# EAGLE design Net4CPC (EAGLE 9.6.2)
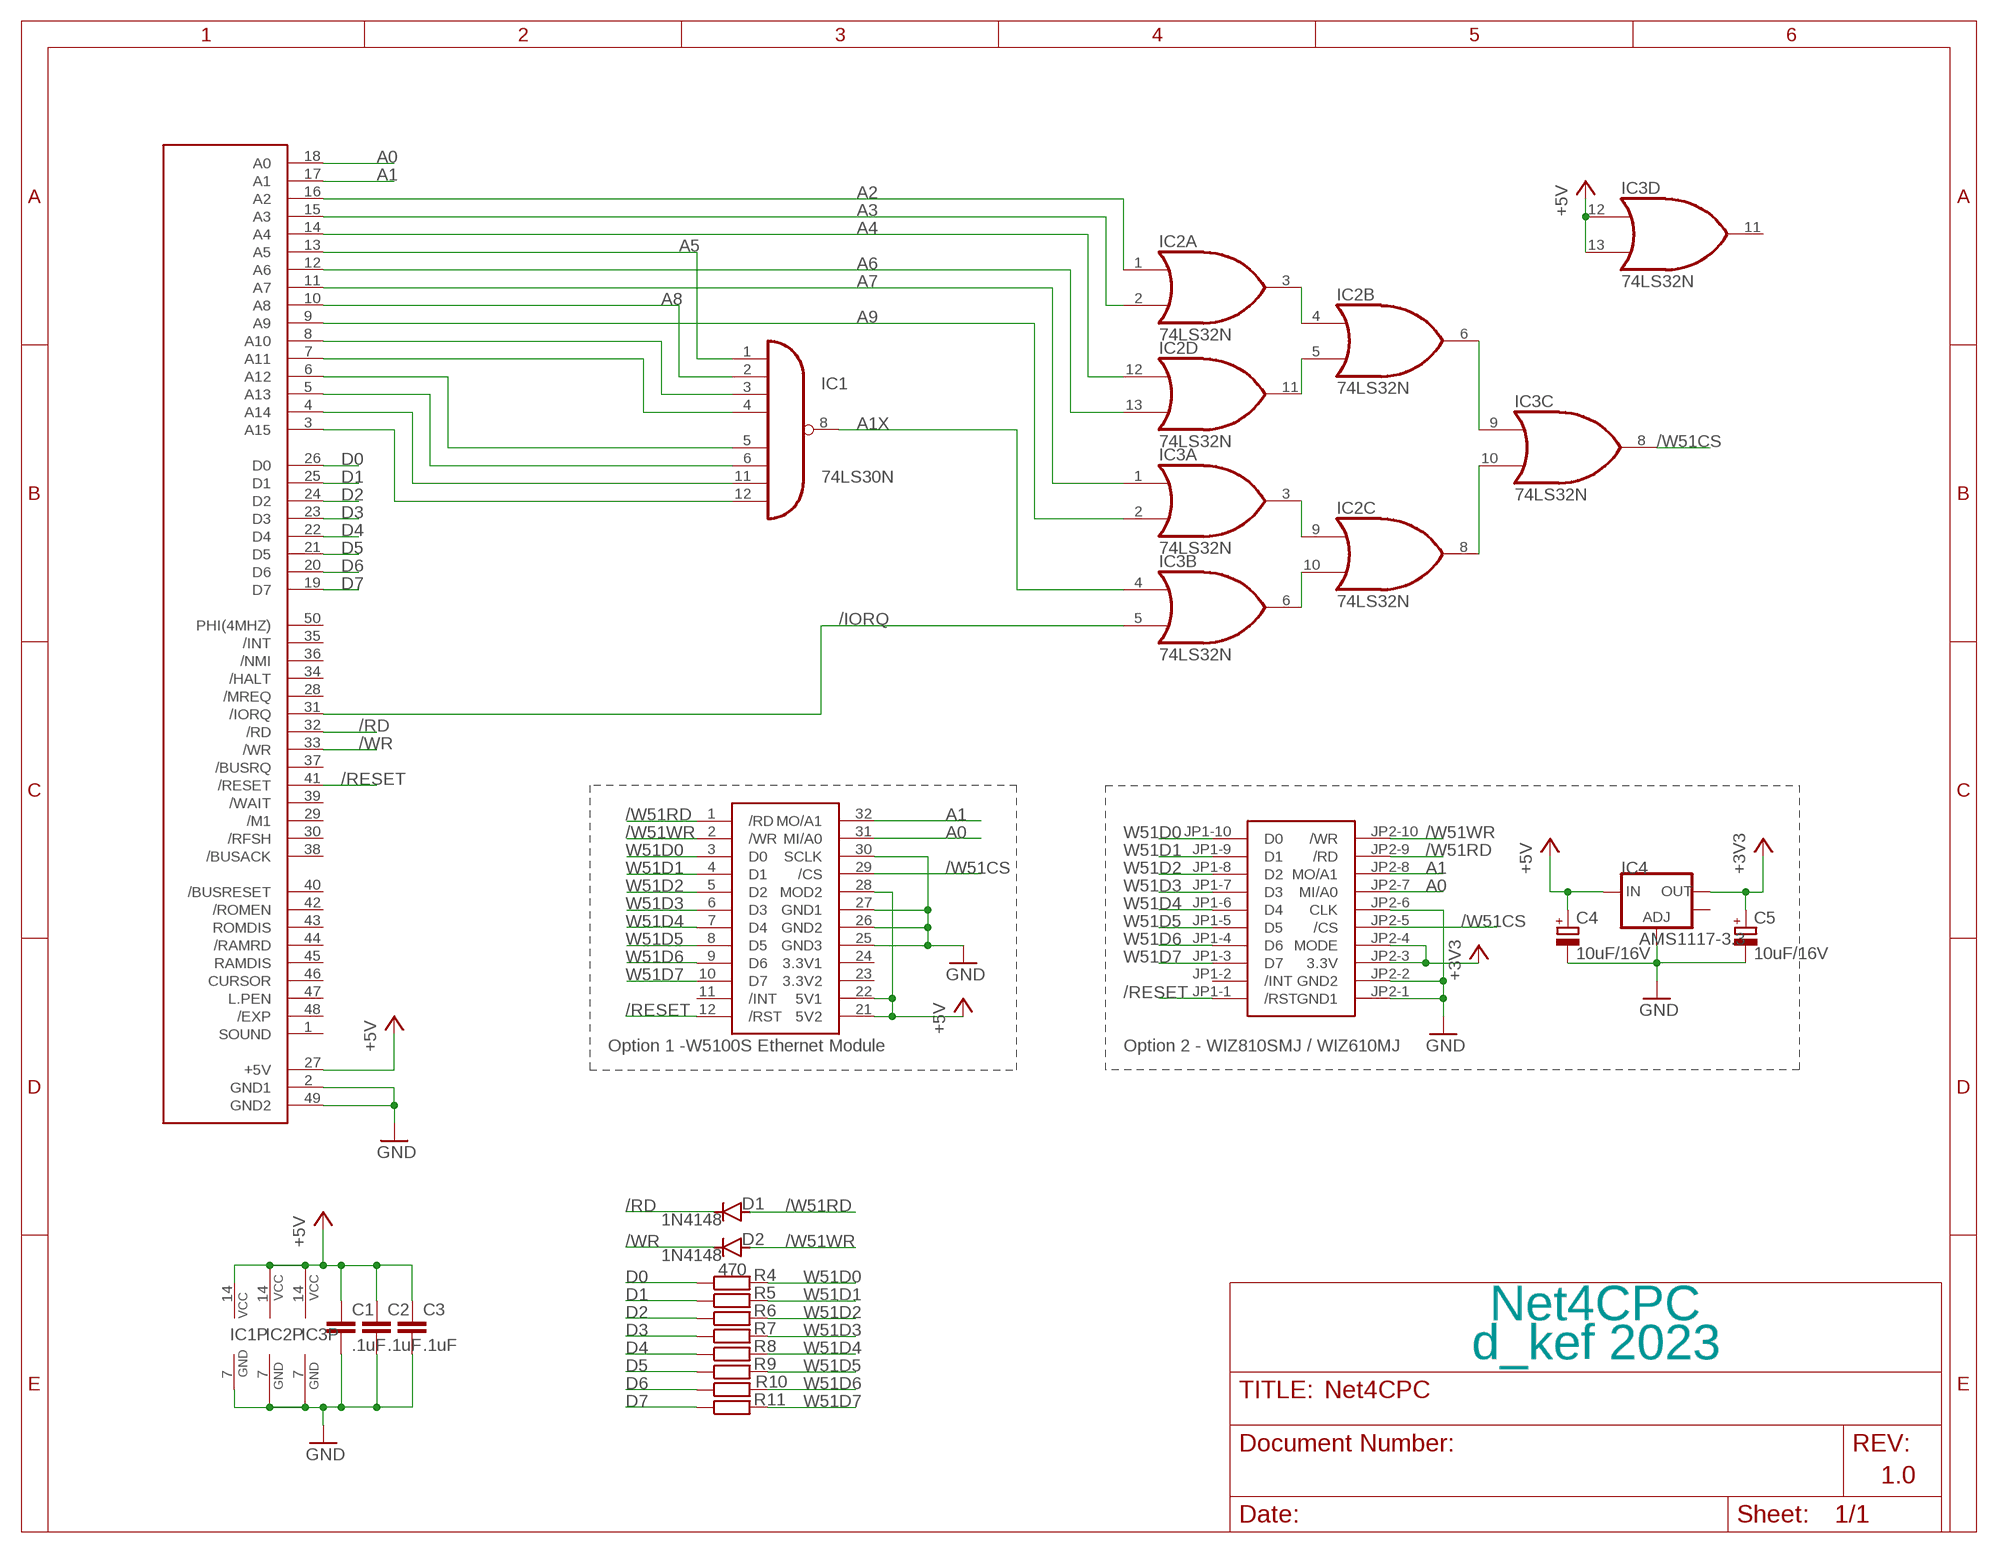
[diagram p0: schematic, sheet 1]
FRAME1 (FRAME_A_L): BANNER1: Net4CPC; BANNER2: d_kef 2023; REVISION: 1.0; TITLE: Net4CPC

## Parts
C1  .1uF  C-EU025-025X050  [C025-025X050]
C2  .1uF  C-EU025-025X050  [C025-025X050]
C3  .1uF  C-EU025-025X050  [C025-025X050]
C4  10uF/16V  CPOL-EUE5-6  [E5-6]
C5  10uF/16V  CPOL-EUE5-6  [E5-6]
CON1  CPCBUS  AMSTRAD_CPC_BUSP  [2X25]
D1  1N4148  1N4148DO35-7  [DO35-7]
D2  1N4148  1N4148DO35-7  [DO35-7]
IC1  74LS30N  74HCT30N  [DIL14]
IC2  74LS32N  [DIL14]
IC3  74LS32N  [DIL14]
IC4  AMS1117-3.3  V_REG_LM1117SOT223  [SOT223]
R4  470  R-EU_0204/7  [0204/7]
R5  470  R-EU_0204/7  [0204/7]
R6  470  R-EU_0204/7  [0204/7]
R7  470  R-EU_0204/7  [0204/7]
R8  470  R-EU_0204/7  [0204/7]
R9  470  R-EU_0204/7  [0204/7]
R10  470  R-EU_0204/7  [0204/7]
R11  470  R-EU_0204/7  [0204/7]
W5100S-MODULE  W5100S-NETWORK-MODULENO-NAMES  [W5100S-NETWORK-MODULE-NO-NAMES]
WIZ810SMJ  WIZ810SMJ-NETWORK-MODULENO-NAMES  [WIZ810SMJ-NETWORK-MODULE-NO-NAMES]

## Nets
+3V3 [power]: C5.+ IC4.2(OUT) WIZ810SMJ.JP2-3(3.3V) WIZ810SMJ.JP2-4(MODE)
+5V [power]: C1.1 C2.1 C3.1 C4.+ CON1.27(+5V) IC1.14(VCC) IC2.14(P:VCC) IC3.12(D:I0) IC3.13(D:I1) IC3.14(P:VCC) IC4.3(IN) W5100S-MODULE.21(5V2) W5100S-MODULE.22(5V1) W5100S-MODULE.28(MOD2)
/IORQ: CON1.31(/IORQ) IC3.5(B:I1)
/RD: CON1.32(/RD) D1.C
/RESET: CON1.41(/RESET) W5100S-MODULE.12(/RST) WIZ810SMJ.JP1-1(/RST)
/W51CS: IC3.8(C:O) W5100S-MODULE.29(/CS) WIZ810SMJ.JP2-5(/CS)
/W51RD: D1.A W5100S-MODULE.1(/RD) WIZ810SMJ.JP2-9(/RD)
/W51WR: D2.A W5100S-MODULE.2(/WR) WIZ810SMJ.JP2-10(/WR)
/WR: CON1.33(/WR) D2.C
A0: CON1.18(A0) W5100S-MODULE.31(MI/A0) WIZ810SMJ.JP2-7(MI/A0)
A1: CON1.17(A1) W5100S-MODULE.32(MO/A1) WIZ810SMJ.JP2-8(MO/A1)
A1X: IC1.8(O) IC3.4(B:I0)
A2: CON1.16(A2) IC2.1(A:I0)
A3: CON1.15(A3) IC2.2(A:I1)
A4: CON1.14(A4) IC2.12(D:I0)
A5: CON1.13(A5) IC1.1(I0)
A6: CON1.12(A6) IC2.13(D:I1)
A7: CON1.11(A7) IC3.1(A:I0)
A8: CON1.10(A8) IC1.2(I1)
A9: CON1.9(A9) IC3.2(A:I1)
A10: CON1.8(A10) IC1.3(I2)
A11: CON1.7(A11) IC1.4(I3)
A12: CON1.6(A12) IC1.5(I4)
A13: CON1.5(A13) IC1.6(I5)
D0: CON1.26(D0) R4.1
D1: CON1.25(D1) R5.1
D2: CON1.24(D2) R6.1
D3: CON1.23(D3) R7.1
D4: CON1.22(D4) R8.1
D5: CON1.21(D5) R9.1
D6: CON1.20(D6) R10.1
D7: CON1.19(D7) R11.1
GND [power]: C1.2 C2.2 C3.2 C4.- C5.- CON1.2(GND1) CON1.49(GND2) IC1.7(GND) IC2.7(P:GND) IC3.7(P:GND) IC4.1(ADJ) W5100S-MODULE.25(GND3) W5100S-MODULE.26(GND2) W5100S-MODULE.27(GND1) W5100S-MODULE.30(SCLK) WIZ810SMJ.JP2-1(GND1) WIZ810SMJ.JP2-2(GND2) WIZ810SMJ.JP2-6(CLK)
N$1: CON1.3(A15) IC1.12(I7)
N$2: CON1.4(A14) IC1.11(I6)
N$3: IC2.3(A:O) IC2.4(B:I0)
N$4: IC2.5(B:I1) IC2.11(D:O)
N$5: IC2.9(C:I0) IC3.3(A:O)
N$6: IC2.10(C:I1) IC3.6(B:O)
N$7: IC2.6(B:O) IC3.9(C:I0)
N$8: IC2.8(C:O) IC3.10(C:I1)
W51D0: R4.2 W5100S-MODULE.3(D0) WIZ810SMJ.JP1-10(D0)
W51D1: R5.2 W5100S-MODULE.4(D1) WIZ810SMJ.JP1-9(D1)
W51D2: R6.2 W5100S-MODULE.5(D2) WIZ810SMJ.JP1-8(D2)
W51D3: R7.2 W5100S-MODULE.6(D3) WIZ810SMJ.JP1-7(D3)
W51D4: R8.2 W5100S-MODULE.7(D4) WIZ810SMJ.JP1-6(D4)
W51D5: R9.2 W5100S-MODULE.8(D5) WIZ810SMJ.JP1-5(D5)
W51D6: R10.2 W5100S-MODULE.9(D6) WIZ810SMJ.JP1-4(D6)
W51D7: R11.2 W5100S-MODULE.10(D7) WIZ810SMJ.JP1-3(D7)
Unconnected: CON1.1(SOUND) CON1.28(/MREQ) CON1.29(/M1) CON1.30(/RFSH) CON1.34(/HALT) CON1.35(/INT) CON1.36(/NMI) CON1.37(/BUSRQ) CON1.38(/BUSACK) CON1.39(/WAIT) CON1.40(/BUSRESET) CON1.42(/ROMEN) CON1.43(ROMDIS) CON1.44(/RAMRD) CON1.45(RAMDIS) CON1.46(CURSOR) CON1.47(L.PEN) CON1.48(/EXP) CON1.50(PHI(4MHZ)) IC3.11(D:O) IC4.4(OUT) W5100S-MODULE.11(/INT) WIZ810SMJ.JP1-2(/INT)

## Notes on the sheet
- Option 1 -W5100S Ethernet Module | Option 2 - WIZ810SMJ / WIZ610MJ

## Power pins joined to a net without a drawn wire
3.3V1: W5100S-MODULE.24(3.3V1)
3.3V2: W5100S-MODULE.23(3.3V2)

## Library data of the parts
C1-C3 = rcl:C-EU: CAPACITOR, European symbol; SPICEPREFIX: C
C4 C5 = rcl:CPOL-EU: POLARIZED CAPACITOR, European symbol; SPICEPREFIX: C
CON1 = CPC:AMSTRAD_CPC_BUS: AMSTRAD CPC BUS CONNECTOR
D1 D2 = diode:1N4148: DIODE high speed (Philips)
IC1 = 74xx-eu:74*30: 8-input NAND gate
IC2 IC3 = 74xx-us:74*32: Quad 2-input OR gate
IC4 = SparkFun:V_REG_LM1117: Voltage Regulator LM1117 Standard adjustable voltage regulator but in SMD form. Spark Fun Electronics SKU : COM-00595
R4-R11 = rcl:R-EU_: RESISTOR, European symbol; SPICEPREFIX: R
W5100S-MODULE = W5100S Network Module:W5100S-NETWORK-MODULE: W5100S Module TCP/IP Ethernet Module SPI / Parallel Control Interface
WIZ810SMJ = WIZ810SMJ Network Module:WIZ810SMJ-NETWORK-MODULE: WIZ810SMJ is the network module that includes W5100S (TCP/IP hardwired chip, include PHY), MAG-JACK (RJ45 with X’FMR) with other glue logics. It can be used as a component and no effort is required to interface W5100S and Transformer.

## Net classes
0 default: width 0.203 mm, drill 0.102 mm, clearance 0.102 mm
1 power: width 0.61 mm, drill 0.102 mm, clearance 0.102 mm

## Board
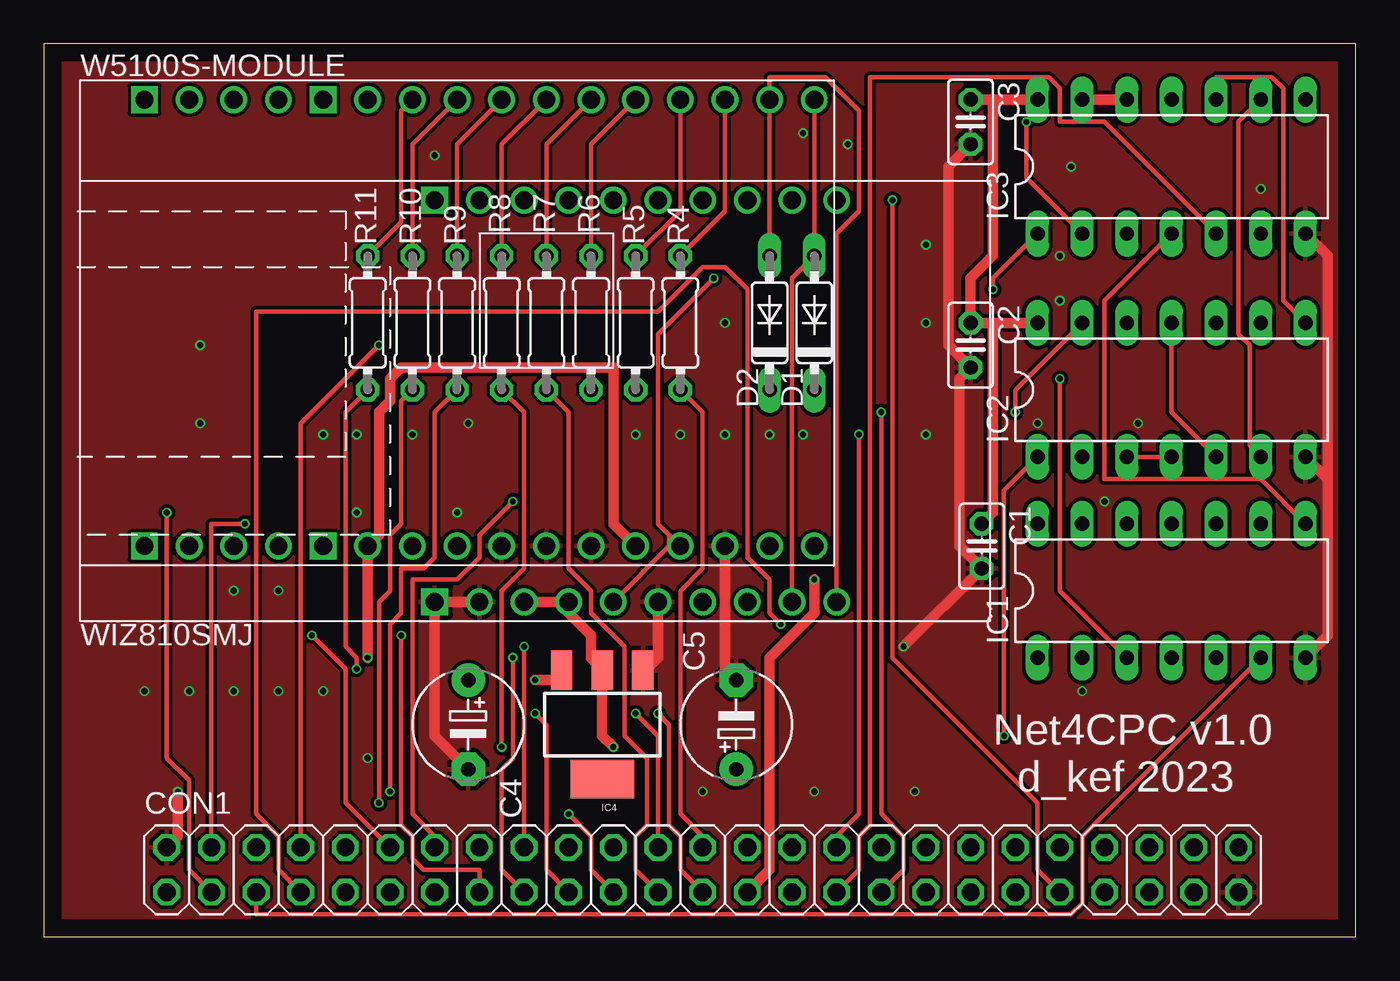
[diagram p1: board, top side]
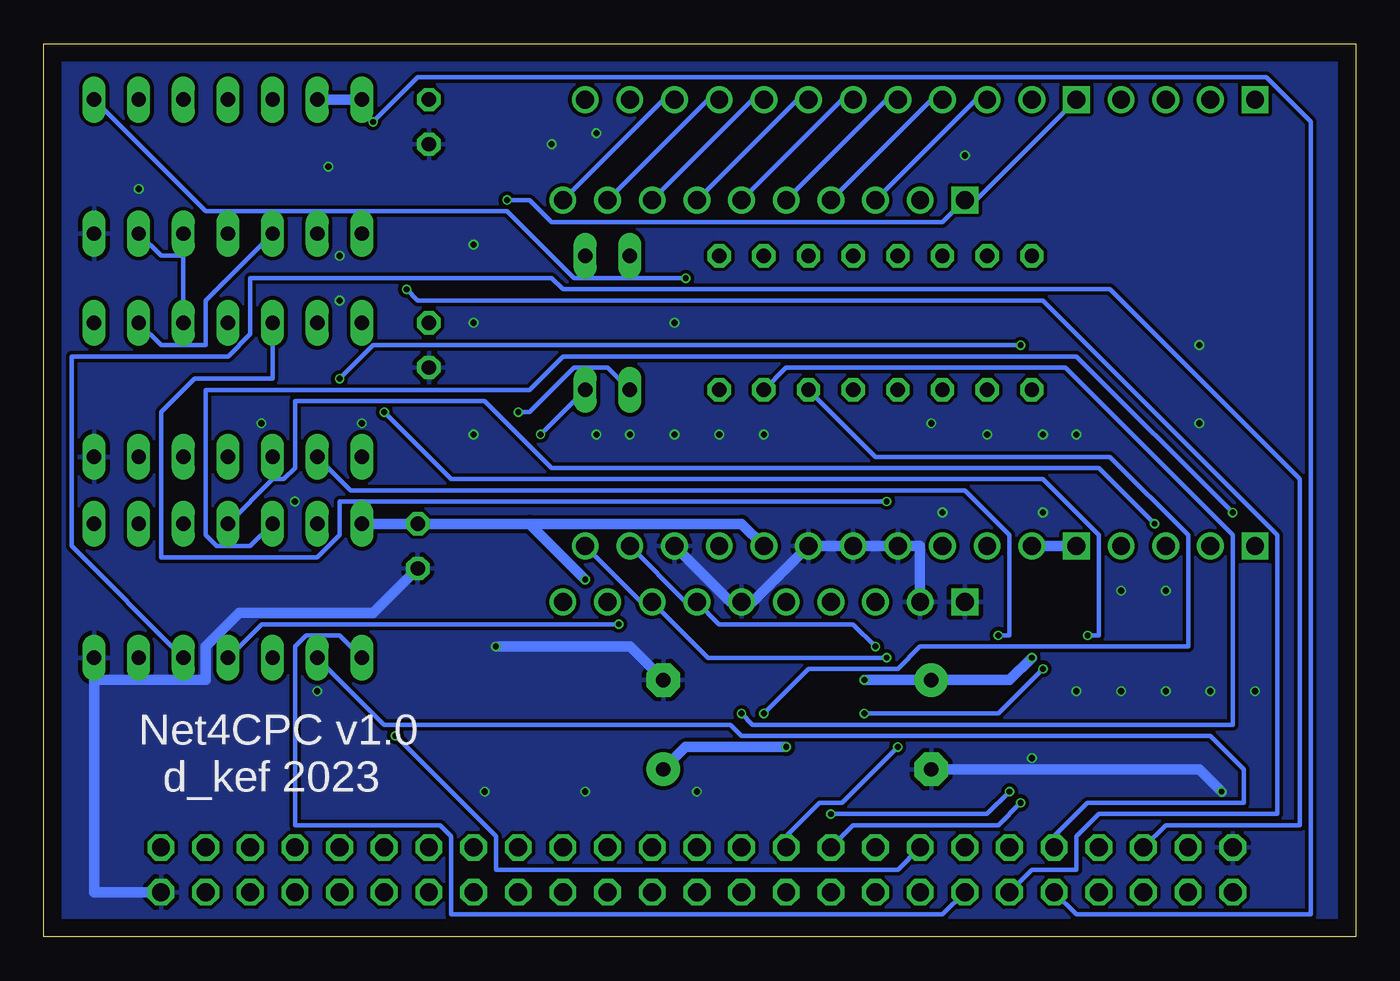
[diagram p2: board, bottom side, seen from below]

Size 74.6 x 50.79 mm. Coordinates in mm from the lower left corner, seen from the top.
Outline: 0,0 74.6,0 74.6,50.79 0,50.79 0,0
Copper layers (1*16): Top 0.035mm / dielectric 1.5mm / Bottom 0.035mm
Design rules "default *": minimum track width 10mil, minimum drill 13mil, track to track 8mil, track to pad 8mil, pad to pad 8mil, via to via 8mil, smd to smd 8mil, copper to edge 40mil, drill to drill 8mil, minimum pad ring 10mil, minimum via ring 4mil, stop-mask expansion 4mil, vias tented up to drill 25mil, thermal gap 10mil

### Footprints (pad centres in the part's own frame; a part is rotated, then mirrored left to right if it is on the bottom)
C025-025X050 = drill 0.813 octagon: 1 -1.27,0; 2 1.27,0
E5-6 = drill 0.813 pad 1.905: + -2.54,0 | drill 0.813 pad 1.905 octagon: - 2.54,0
2X25 = drill 1.016 octagon: 1 -30.48,-1.27; 2 -30.48,1.27; 3 -27.94,-1.27; 4 -27.94,1.27; 5 -25.4,-1.27; 6 -25.4,1.27; 7 -22.86,-1.27; 8 -22.86,1.27; 9 -20.32,-1.27; 10 -20.32,1.27; 11 -17.78,-1.27; 12 -17.78,1.27; 13 -15.24,-1.27; 14 -15.24,1.27; 15 -12.7,-1.27; 16 -12.7,1.27; 17 -10.16,-1.27; 18 -10.16,1.27; 19 -7.62,-1.27; 20 -7.62,1.27; 21 -5.08,-1.27; 22 -5.08,1.27; 23 -2.54,-1.27; 24 -2.54,1.27; 25 0,-1.27; 26 0,1.27; 27 2.54,-1.27; 28 2.54,1.27; 29 5.08,-1.27; 30 5.08,1.27; 31 7.62,-1.27; 32 7.62,1.27; 33 10.16,-1.27; 34 10.16,1.27; 35 12.7,-1.27; 36 12.7,1.27; 37 15.24,-1.27; 38 15.24,1.27; 39 17.78,-1.27; 40 17.78,1.27; 41 20.32,-1.27; 42 20.32,1.27; 43 22.86,-1.27; 44 22.86,1.27; 45 25.4,-1.27; 46 25.4,1.27; 47 27.94,-1.27; 48 27.94,1.27; 49 30.48,-1.27; 50 30.48,1.27
DO35-7 = drill 0.813 long: A 3.81,0; C -3.81,0
DIL14 = drill 0.813 long: 1 -7.62,-3.81; 2 -5.08,-3.81; 3 -2.54,-3.81; 4 0,-3.81; 5 2.54,-3.81; 6 5.08,-3.81; 7 7.62,-3.81; 8 7.62,3.81; 9 5.08,3.81; 10 2.54,3.81; 11 0,3.81; 12 -2.54,3.81; 13 -5.08,3.81; 14 -7.62,3.81
SOT223 = smd 1.219 x 2.235: 1 -2.311,-3.099; 2 0,-3.099; 3 2.311,-3.099 | smd 3.6 x 2.2: 4 0,3.099
0204/7 = drill 0.813 octagon: 1 -3.81,0; 2 3.81,0
W5100S-NETWORK-MODULE-NO-NAMES = drill 1.016: 1 -12.7,19.05; 2 -12.7,16.51; 3 -12.7,13.97; 4 -12.7,11.43; 5 -12.7,8.89; 6 -12.7,6.35; 7 -12.7,3.81; 8 -12.7,1.27; 9 -12.7,-1.27; 10 -12.7,-3.81; 11 -12.7,-6.35; 13 -12.7,-11.43; 14 -12.7,-13.97; 15 -12.7,-16.51; 18 12.7,-16.51; 19 12.7,-13.97; 20 12.7,-11.43; 22 12.7,-6.35; 23 12.7,-3.81; 24 12.7,-1.27; 25 12.7,1.27; 26 12.7,3.81; 27 12.7,6.35; 28 12.7,8.89; 29 12.7,11.43; 30 12.7,13.97; 31 12.7,16.51; 32 12.7,19.05 | drill 1.016 square: 12 -12.7,-8.89; 16 -12.7,-19.05; 17 12.7,-19.05; 21 12.7,-8.89
WIZ810SMJ-NETWORK-MODULE-NO-NAMES = drill 1.016 square: JP1-1 11.43,7.62; JP2-1 -11.43,7.62 | drill 1.016: JP1-2 11.43,5.08; JP1-3 11.43,2.54; JP1-4 11.43,0; JP1-5 11.43,-2.54; JP1-6 11.43,-5.08; JP1-7 11.43,-7.62; JP1-8 11.43,-10.16; JP1-9 11.43,-12.7; JP1-10 11.43,-15.24; JP2-2 -11.43,5.08; JP2-3 -11.43,2.54; JP2-4 -11.43,0; JP2-5 -11.43,-2.54; JP2-6 -11.43,-5.08; JP2-7 -11.43,-7.62; JP2-8 -11.43,-10.16; JP2-9 -11.43,-12.7; JP2-10 -11.43,-15.24

### Placement (x,y rotation side)
C1  53.34,22.23 270 top
C2  52.7,33.65 270 top
C3  52.7,46.35 270 top
C4  1uF/16V  [E5-6]  24.13,12.07 270 top
C5  1uF/16V  [E5-6]  39.37,12.07 90 top
CON1  37.47,3.81 0 top
D1  43.81,34.92 90 top
D2  41.28,34.92 90 top
IC1  64.13,19.68 0 top
IC2  64.13,31.11 0 top
IC3  64.13,43.81 0 top
IC4  31.75,12.07 180 top
R4  36.19,34.92 90 top
R5  33.66,34.92 90 top
R6  31.11,34.92 90 top
R7  28.57,34.92 90 top
R8  26.04,34.92 90 top
R9  23.5,34.92 90 top
R10  20.96,34.92 90 top
R11  18.42,34.92 90 top
W5100S-MODULE  24.76,34.92 270 top
WIZ810SMJ  29.85,30.48 90 top

### Tracks (layer width: path | path; a pad name or v marks a point on that pad's centre or on a via)
+3V3  (via drill 0.33)
  Top 0.61: WIZ810SMJ.JP2-3 WIZ810SMJ.JP2-4 29.85,18.41 31.11,17.14 31.11,15.88 31.75,15.24 IC4.2 31.75,11.43 v32.39,10.79
  Bottom 0.61: C5.+ 38.1,10.79 v32.39,10.79
+5V  (via drill 0.33)
  Top 0.61: v27.94,14.61 29.21,14.61 IC4.3 | v18.42,15.88 W5100S-MODULE.22 19.05,22.86 19.05,29.84 19.68,30.48 19.68,31.75 20.32,32.38 32.39,32.38 32.39,23.5 W5100S-MODULE.28 | IC3.12 IC3.13 | IC3.14 53.97,47.62 | 53.97,47.62 C3.1 | IC2.14 53.97,34.92 | 53.97,34.92 C2.1 52.7,37.46 53.97,38.73 53.97,47.62 | CON1.27 41.28,3.81 41.28,15.88 43.81,18.41 v43.81,20.32 | 53.97,34.92 53.97,24.13 C1.1
  Bottom 0.61: W5100S-MODULE.22 W5100S-MODULE.21 | v27.94,14.61 C4.+ 19.68,14.61 v18.42,15.88 | IC3.14 IC3.13 | IC1.14 C1.1 46.99,23.5 | W5100S-MODULE.28 34.92,23.5 46.99,23.5 | 46.99,23.5 v43.81,20.32
/IORQ
  Top 0.254: IC3.5 60.33,46.35 57.78,46.35 57.78,48.26 57.15,48.89 46.99,48.89 46.99,6.35 46.36,5.71 46.36,3.81 CON1.31
/RD  (via drill 0.33)
  Top 0.254: v46.36,28.57 46.36,6.99 45.08,5.71 CON1.32
  Bottom 0.254: v46.36,28.57 D1.C
/RESET  (via drill 0.33)
  Top 0.254: CON1.41 56.52,3.81 56.52,7.62 48.26,15.88 v48.26,41.91
  Bottom 0.254: v48.26,41.91 46.99,41.91 45.72,40.64 23.5,40.64 WIZ810SMJ.JP1-1 21.59,41.91 W5100S-MODULE.12
/W51CS  (via drill 0.33)
  Top 0.254: v38.1,37.46 34.92,34.29 34.92,23.5 35.56,22.86 | W5100S-MODULE.29 35.56,22.86 | WIZ810SMJ.JP2-5 35.56,22.23 35.56,22.86
  Bottom 0.254: IC3.8 65.41,41.27 48.26,41.27 44.45,37.46 v38.1,37.46
/W51RD
  Top 0.254: W5100S-MODULE.1 D1.A 42.55,37.46 WIZ810SMJ.JP2-9
/W51WR
  Top 0.254: D2.A W5100S-MODULE.2 41.28,48.89 44.45,48.89 46.36,46.99 46.36,41.27 45.08,40 WIZ810SMJ.JP2-10
/WR  (via drill 0.33)
  Top 0.254: v47.62,29.84 47.62,6.99 48.89,5.71 48.89,3.81 CON1.33
  Bottom 0.254: D2.C 42.55,32.38 44.45,32.38 46.99,29.84 v47.62,29.84
A0  (via drill 0.33)
  Top 0.254: v27.3,16.51 CON1.18
  Bottom 0.254: v27.3,16.51 28.57,17.78 36.19,17.78 WIZ810SMJ.JP2-7 38.1,19.05 W5100S-MODULE.31
A1  (via drill 0.33)
  Top 0.254: CON1.17 26.04,3.81 26.04,9.53 26.67,10.16 v26.67,15.88
  Bottom 0.254: v26.67,15.88 36.83,15.88 WIZ810SMJ.JP2-8 40.64,19.05 W5100S-MODULE.32
A1X
  Top 0.254: IC1.8 69.21,26.04 60.33,26.04 60.33,36.2 IC3.4
A2  (via drill 0.33)
  Top 0.254: IC2.1 54.61,25.4 v54.61,11.43
  Bottom 0.254: v54.61,11.43 48.89,5.71 48.89,3.81 26.04,3.81 CON1.16
A3  (via drill 0.33)
  Top 0.254: v20.32,17.14 20.32,6.35 20.96,5.71 20.96,4.45 21.59,3.81 24.76,3.81 CON1.15
  Bottom 0.254: IC2.2 57.15,25.4 22.22,25.4 19.68,22.86 19.68,17.14 v20.32,17.14
A4  (via drill 0.33)
  Top 0.254: v26.67,24.77 24.76,22.86 24.76,21.59 23.5,20.32 20.96,20.32 20.96,6.99 22.22,5.71 CON1.14
  Bottom 0.254: IC2.12 61.59,31.75 66.04,31.75 67.94,29.84 67.94,21.59 59.05,21.59 57.78,22.86 57.78,24.77 v26.67,24.77
A5
  Bottom 0.254: IC1.1 57.78,17.14 59.69,17.14 60.33,16.51 60.33,6.35 52.07,6.35 51.44,5.71 51.44,1.27 23.5,1.27 CON1.13
A6  (via drill 0.33)
  Top 0.254: IC2.13 55.24,31.11 v55.24,29.84 | v15.24,17.14 17.14,15.24 17.14,7.62 CON1.12
  Bottom 0.254: v55.24,29.84 51.44,26.04 17.78,26.04 14.61,22.86 14.61,17.14 v15.24,17.14
A7  (via drill 0.33)
  Top 0.254: IC3.1 53.97,37.46 v53.97,36.83
  Bottom 0.254: v53.97,36.83 53.34,36.2 17.78,36.2 4.45,22.86 4.45,6.99 14.61,6.99 15.88,5.71 15.88,3.81 18.42,3.81 CON1.11
A8
  Bottom 0.254: IC1.2 55.24,12.07 35.56,12.07 34.92,11.43 8.25,11.43 6.35,9.53 6.35,7.62 15.24,7.62 17.14,5.71 CON1.10
A9  (via drill 0.33)
  Top 0.254: IC3.2 55.88,43.18 v55.88,46.35
  Bottom 0.254: v55.88,46.35 53.34,48.89 5.08,48.89 2.54,46.35 2.54,1.27 15.88,1.27 CON1.9
A10  (via drill 0.33)
  Top 0.254: IC1.3 57.78,19.68 v57.78,31.75 | v19.05,33.65 14.61,29.21 CON1.8
  Bottom 0.254: v57.78,31.75 55.88,33.65 v19.05,33.65
A11  (via drill 0.33)
  Top 0.254: v41.91,17.78 41.28,18.41 41.28,20.32 40,21.59 40,36.83 38.73,38.1 37.47,38.1 34.92,35.56 12.07,35.56 12.07,6.99 13.34,5.71 13.34,3.81 CON1.7
  Bottom 0.254: IC1.4 62.23,17.78 v41.91,17.78
A12
  Bottom 0.254: IC1.5 73.02,22.23 73.02,33.02 64.13,33.02 62.86,34.29 62.86,37.46 45.72,37.46 45.08,36.83 13.97,36.83 3.18,26.04 3.18,6.35 10.79,6.35 CON1.6
A13
  Top 0.254: IC1.6 59.05,5.71 59.05,1.9 58.42,1.27 12.07,1.27 CON1.5
D0
  Top 0.254: R4.1 37.47,29.84 37.47,20.96 36.19,19.68 36.19,6.99 37.47,5.71 CON1.26
D1  (via drill 0.33)
  Top 0.254: v34.92,12.7 35.56,12.07 35.56,6.35 36.19,5.71 36.19,3.81 CON1.25
  Bottom 0.254: R5.1 32.39,32.38 16.51,32.38 6.98,22.86 6.98,12.07 34.29,12.07 v34.92,12.7
D2  (via drill 0.33)
  Top 0.254: v33.66,12.7 34.92,11.43 CON1.24
  Bottom 0.254: R6.1 27.3,27.3 13.97,27.3 9.52,22.86 9.52,16.51 24.76,16.51 26.04,15.24 31.11,15.24 v33.66,12.7
D3
  Top 0.254: R7.1 29.85,29.84 29.85,20.96 31.11,19.68 31.11,18.41 33.02,16.51 33.02,11.43 34.29,10.16 34.29,6.35 33.66,5.71 33.66,3.81 CON1.23
D4  (via drill 0.33)
  Top 0.254: R8.1 27.3,29.84 27.3,20.96 26.04,19.68 v26.04,10.79
  Bottom 0.254: v26.04,10.79 29.21,7.62 30.48,7.62 32.39,5.71 CON1.22
D5  (via drill 0.33)
  Top 0.254: R9.1 22.22,29.84 22.22,21.59 21.59,20.96 20.32,20.96 20.32,18.41 19.68,17.78 v19.68,8.26 | v29.85,6.99 31.11,5.71 31.11,3.81 CON1.21
  Bottom 0.254: v19.68,8.26 20.96,6.99 v29.85,6.99
D6  (via drill 0.33)
  Top 0.254: R10.1 20.32,30.48 20.32,23.5 19.68,22.86 19.68,19.68 19.05,19.05 v19.05,7.62
  Bottom 0.254: v19.05,7.62 20.32,6.35 28.57,6.35 CON1.20
D7  (via drill 0.33)
  Top 0.254: R11.1 17.14,29.84 17.14,16.51 17.78,15.88 v17.78,15.24 | v27.94,12.7 28.57,12.07 28.57,3.81 CON1.19
  Bottom 0.254: v17.78,15.24 20.32,12.7 v27.94,12.7
GND  (via drill 0.33, 0.35)
  Top 0.61: CON1.2 7.62,5.71 v7.62,8.26 | WIZ810SMJ.JP2-2 WIZ810SMJ.JP2-1 22.22,11.43 C4.- | WIZ810SMJ.JP2-6 34.92,15.88 34.29,15.24 IC4.1 | C5.- 38.73,15.24 W5100S-MODULE.30 | C3.2 51.44,43.81 51.44,33.65 C2.2 52.07,31.75 52.07,22.23 C1.2 v48.89,16.51 | 73.02,26.04 IC2.7 | 73.02,26.04 73.02,17.14 IC1.7 | IC3.7 73.02,38.73 73.02,26.04
  Bottom 0.61: v7.62,8.26 8.89,9.53 C4.- | WIZ810SMJ.JP2-2 24.76,22.23 W5100S-MODULE.25 W5100S-MODULE.26 W5100S-MODULE.27 34.29,19.05 WIZ810SMJ.JP2-6 35.56,19.05 W5100S-MODULE.30 | 71.75,14.61 71.75,2.54 CON1.49 | 71.75,14.61 IC1.7 | C1.2 55.88,18.41 63.5,18.41 65.41,16.51 65.41,14.61 71.75,14.61 | C5.- 41.28,16.51 v48.89,16.51
  other vias: 37.47,8.26 43.81,8.26 49.53,8.26 59.05,13.97 38.73,34.92 50.16,34.92 50.16,28.57 38.73,28.57 23.5,24.13 24.13,29.21 15.88,28.57 8.89,29.21 8.89,33.65 5.71,13.97 10.79,13.97 10.79,19.68 50.16,39.37 57.78,38.73 58.42,43.81 62.23,29.21 56.52,29.21 57.78,36.2 69.21,42.54 45.72,45.08 43.18,45.72 43.18,28.57 41.28,28.57 8.25,13.97 13.34,13.97 15.88,13.97 36.19,28.57 33.66,28.57 13.34,19.68 18.42,10.16 17.78,28.57 20.96,28.57 17.78,24.13 60.33,24.77 22.22,44.45
  pour Top: 0,50.8 74.93,50.8 74.93,0 0,0
  pour Bottom: 0,50.8 74.93,50.8 74.93,0 0,0
N$1  (via drill 0.33)
  Top 0.254: v6.98,24.13 6.98,10.16 8.25,8.89 8.25,3.81 CON1.3
  Bottom 0.254: IC1.12 62.86,22.23 64.77,22.23 65.41,22.86 65.41,31.11 46.99,31.11 45.08,33.02 15.88,33.02 v6.98,24.13
N$2  (via drill 0.33)
  Top 0.254: v11.43,23.5 9.52,23.5 CON1.4
  Bottom 0.254: IC1.11 61.59,26.04 60.96,26.04 60.33,26.67 60.33,30.48 49.53,30.48 45.72,26.67 14.61,26.67 v11.43,23.5
N$3
  Top 0.254: IC2.4 IC2.3
N$4
  Top 0.254: IC2.5 64.13,29.84 IC2.11
N$5
  Bottom 0.254: IC3.3 65.41,36.2 65.41,33.65 67.94,33.65 IC2.9
N$6
  Bottom 0.254: IC2.10 66.67,38.73 67.94,38.73 IC3.6
N$7
  Top 0.254: IC2.6 68.58,27.94 68.58,33.65 67.94,34.29 67.94,46.35 IC3.9
N$8
  Top 0.254: IC2.8 70.48,36.2 70.48,48.26 69.85,48.89 66.67,48.89 IC3.10
W51D0
  Top 0.254: R4.2 38.73,41.27 W5100S-MODULE.3
  Bottom 0.254: WIZ810SMJ.JP1-10 39.37,47.62 W5100S-MODULE.3
W51D1
  Top 0.254: R5.2 36.19,41.27 W5100S-MODULE.4
  Bottom 0.254: WIZ810SMJ.JP1-9 36.83,47.62 W5100S-MODULE.4
W51D2
  Top 0.254: R6.2 31.11,45.08 W5100S-MODULE.5
  Bottom 0.254: WIZ810SMJ.JP1-8 34.29,47.62 W5100S-MODULE.5
W51D3
  Top 0.254: R7.2 28.57,45.08 W5100S-MODULE.6
  Bottom 0.254: WIZ810SMJ.JP1-7 31.75,47.62 W5100S-MODULE.6
W51D4
  Top 0.254: R8.2 26.04,45.08 W5100S-MODULE.7
  Bottom 0.254: WIZ810SMJ.JP1-6 29.21,47.62 W5100S-MODULE.7
W51D5
  Top 0.254: R9.2 23.5,45.08 W5100S-MODULE.8
  Bottom 0.254: WIZ810SMJ.JP1-5 26.67,47.62 W5100S-MODULE.8
W51D6
  Top 0.254: R10.2 20.96,45.08 W5100S-MODULE.9
  Bottom 0.254: WIZ810SMJ.JP1-4 24.13,47.62 W5100S-MODULE.9
W51D7
  Top 0.254: R11.2 20.32,40.64 20.32,46.99 W5100S-MODULE.10
  Bottom 0.254: WIZ810SMJ.JP1-3 21.59,47.62 W5100S-MODULE.10

### Text on the board
tNames: Net4CPC v1.0 / d_kef 2023
bNames: Net4CPC v1.0 / d_kef 2023